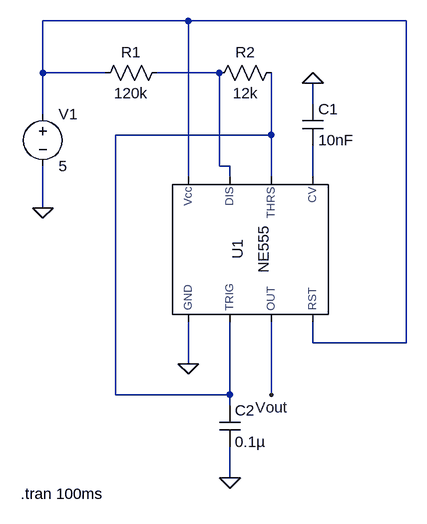
[diagram p0: schematic 100Hz timer 90% duty cycle.asc]
100Hz timer 90% duty cycle.asc, the LTspice schematic file:
Version 4
SHEET 1 880 680
WIRE 112 -176 -112 -176
WIRE 448 -176 112 -176
WIRE -112 -96 -112 -176
WIRE -16 -96 -112 -96
WIRE 160 -96 64 -96
WIRE 304 -48 304 -80
WIRE -112 -32 -112 -96
WIRE 240 0 240 -96
WIRE 240 0 0 0
WIRE 160 48 160 -96
WIRE 176 48 160 48
WIRE 112 64 112 -176
WIRE 176 64 176 48
WIRE 240 64 240 0
WIRE 304 64 304 16
WIRE -112 112 -112 48
WIRE 304 320 304 288
WIRE 448 320 448 -176
WIRE 448 320 304 320
WIRE 112 352 112 288
WIRE 0 400 0 0
WIRE 176 400 176 288
WIRE 176 400 0 400
WIRE 240 400 240 288
WIRE 176 416 176 400
WIRE 176 528 176 480
FLAG 112 352 0
FLAG 304 -80 0
FLAG -112 112 0
FLAG 176 528 0
FLAG 240 400 Vout
SYMBOL Misc\\NE555 208 176 R270
SYMATTR InstName U1
SYMBOL cap 288 -48 R0
SYMATTR InstName C1
SYMATTR Value 10nF
SYMBOL res 144 -80 R270
WINDOW 0 32 56 VTop 2
WINDOW 3 0 56 VBottom 2
SYMATTR InstName R2
SYMATTR Value 12k
SYMBOL voltage -112 -48 R0
WINDOW 123 0 0 Left 2
WINDOW 39 0 0 Left 2
SYMATTR InstName V1
SYMATTR Value 5
SYMBOL res -32 -80 R270
WINDOW 0 32 56 VTop 2
WINDOW 3 0 56 VBottom 2
SYMATTR InstName R1
SYMATTR Value 120k
SYMBOL cap 160 416 R0
SYMATTR InstName C2
SYMATTR Value 0.1µ
TEXT -146 552 Left 2 !.tran 100ms

The netlist it stands for:
* 100Hz timer 90% duty cycle.asc
XU1 0 N003 Vout N001 N004 N003 N002 N001 NE555  ; pins GND TRIG OUT RST CV THRS DIS Vcc
C1 0 N004 10nF
R2 N002 N003 12k
V1 N001 0 5
R1 N001 N002 120k
C2 N003 0 0.1µ
.tran 100ms
.lib NE555.sub
.backanno
.end